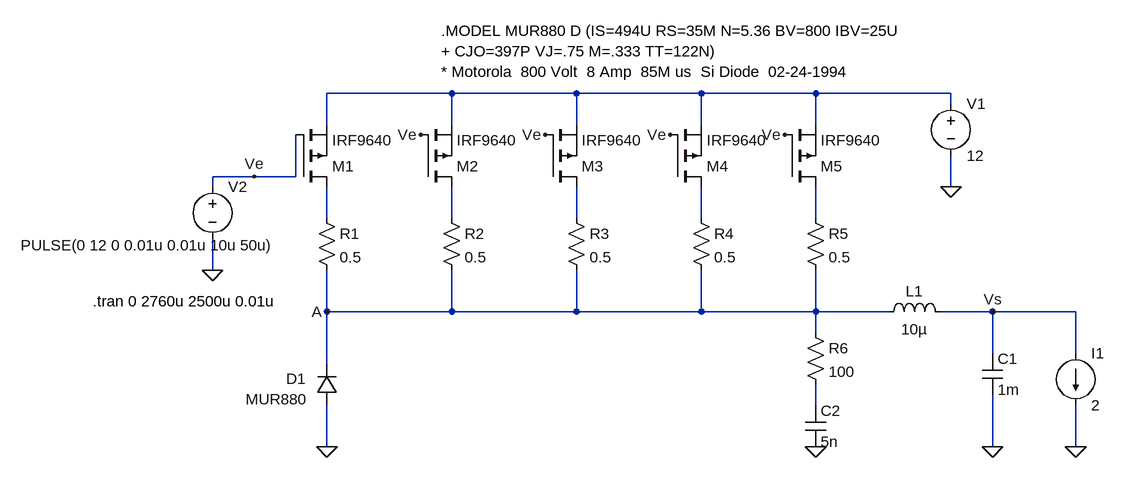
[diagram p0: schematic ej_conmu2.asc]
ej_conmu2.asc, the LTspice schematic file:
Version 4
SHEET 1 1988 680
WIRE 304 64 112 64
WIRE 496 64 304 64
WIRE 688 64 496 64
WIRE 864 64 688 64
WIRE 1072 64 864 64
WIRE 1072 80 1072 64
WIRE 112 112 112 64
WIRE 304 112 304 64
WIRE 496 112 496 64
WIRE 688 112 688 64
WIRE 864 112 864 64
WIRE 0 192 -64 192
WIRE 64 192 64 128
WIRE 64 192 0 192
WIRE -64 208 -64 192
WIRE 1072 208 1072 160
WIRE 112 256 112 208
WIRE 304 256 304 208
WIRE 496 256 496 208
WIRE 688 256 688 208
WIRE 864 256 864 208
WIRE -64 336 -64 288
WIRE 112 400 112 336
WIRE 304 400 304 336
WIRE 304 400 112 400
WIRE 496 400 496 336
WIRE 496 400 304 400
WIRE 688 400 688 336
WIRE 688 400 496 400
WIRE 864 400 864 336
WIRE 864 400 688 400
WIRE 976 400 864 400
WIRE 1136 400 1056 400
WIRE 1264 400 1136 400
WIRE 864 432 864 400
WIRE 1136 464 1136 400
WIRE 1264 464 1264 400
WIRE 112 480 112 400
WIRE 864 544 864 512
WIRE 112 608 112 544
WIRE 1136 608 1136 528
WIRE 1264 608 1264 544
FLAG 1072 208 0
FLAG -64 336 0
FLAG 1264 608 0
FLAG 1136 608 0
FLAG 256 128 Ve
FLAG 448 128 Ve
FLAG 640 128 Ve
FLAG 816 128 Ve
FLAG 0 192 Ve
FLAG 864 608 0
FLAG 112 608 0
FLAG 112 400 A
FLAG 1136 400 Vs
SYMBOL pmos 64 208 M180
SYMATTR InstName M1
SYMATTR Value IRF9640
SYMBOL pmos 256 208 M180
SYMATTR InstName M2
SYMATTR Value IRF9640
SYMBOL pmos 448 208 M180
SYMATTR InstName M3
SYMATTR Value IRF9640
SYMBOL pmos 640 208 M180
SYMATTR InstName M4
SYMATTR Value IRF9640
SYMBOL pmos 816 208 M180
SYMATTR InstName M5
SYMATTR Value IRF9640
SYMBOL res 96 240 R0
SYMATTR InstName R1
SYMATTR Value 0.5
SYMBOL res 288 240 R0
SYMATTR InstName R2
SYMATTR Value 0.5
SYMBOL res 480 240 R0
SYMATTR InstName R3
SYMATTR Value 0.5
SYMBOL res 672 240 R0
SYMATTR InstName R4
SYMATTR Value 0.5
SYMBOL res 848 240 R0
SYMATTR InstName R5
SYMATTR Value 0.5
SYMBOL voltage 1072 64 R0
WINDOW 123 0 0 Left 2
WINDOW 39 0 0 Left 2
SYMATTR InstName V1
SYMATTR Value 12
SYMBOL voltage -64 192 R0
WINDOW 123 0 0 Left 2
WINDOW 39 0 0 Left 2
WINDOW 3 -295 106 Left 2
SYMATTR Value PULSE(0 12 0 0.01u 0.01u 10u 50u)
SYMATTR InstName V2
SYMBOL ind 960 416 R270
WINDOW 0 32 56 VTop 2
WINDOW 3 5 56 VBottom 2
SYMATTR InstName L1
SYMATTR Value 10µ
SYMBOL cap 1120 464 R0
SYMATTR InstName C1
SYMATTR Value 1m
SYMBOL current 1264 464 R0
WINDOW 123 0 0 Left 2
WINDOW 39 0 0 Left 2
SYMATTR InstName I1
SYMATTR Value 2
SYMBOL res 848 416 R0
SYMATTR InstName R6
SYMATTR Value 100
SYMBOL cap 848 544 R0
SYMATTR InstName C2
SYMATTR Value 5n
SYMBOL diode 128 544 R180
WINDOW 0 48 41 Left 2
WINDOW 3 46 9 Left 2
SYMATTR InstName D1
SYMATTR Value MUR880
TEXT -248 384 Left 2 !.tran 0 2760u 2500u 0.01u
TEXT 288 -32 Left 2 !.MODEL MUR880 D (IS=494U RS=35M N=5.36 BV=800 IBV=25U\n+ CJO=397P VJ=.75 M=.333 TT=122N)\n* Motorola  800 Volt  8 Amp  85M us  Si Diode  02-24-1994

The netlist it stands for:
* ej_conmu2.asc
M1 N002 Ve N001 N001 IRF9640
M2 N003 Ve N001 N001 IRF9640
M3 N004 Ve N001 N001 IRF9640
M4 N005 Ve N001 N001 IRF9640
M5 N006 Ve N001 N001 IRF9640
R1 N002 A 0.5
R2 N003 A 0.5
R3 N004 A 0.5
R4 N005 A 0.5
R5 N006 A 0.5
V1 N001 0 12
V2 Ve 0 PULSE(0 12 0 0.01u 0.01u 10u 50u)
L1 A Vs 10µ
C1 Vs 0 1m
I1 Vs 0 2
R6 A N007 100
C2 N007 0 5n
D1 0 A MUR880
.model D D
.lib standard.dio
.model NMOS NMOS
.model PMOS PMOS
.lib standard.mos
.tran 0 2760u 2500u 0.01u
.MODEL MUR880 D (IS=494U RS=35M N=5.36 BV=800 IBV=25U
+ CJO=397P VJ=.75 M=.333 TT=122N)
* Motorola  800 Volt  8 Amp  85M us  Si Diode  02-24-1994
.backanno
.end